# EAGLE design SaV64_v140 (EAGLE 7.4.0)
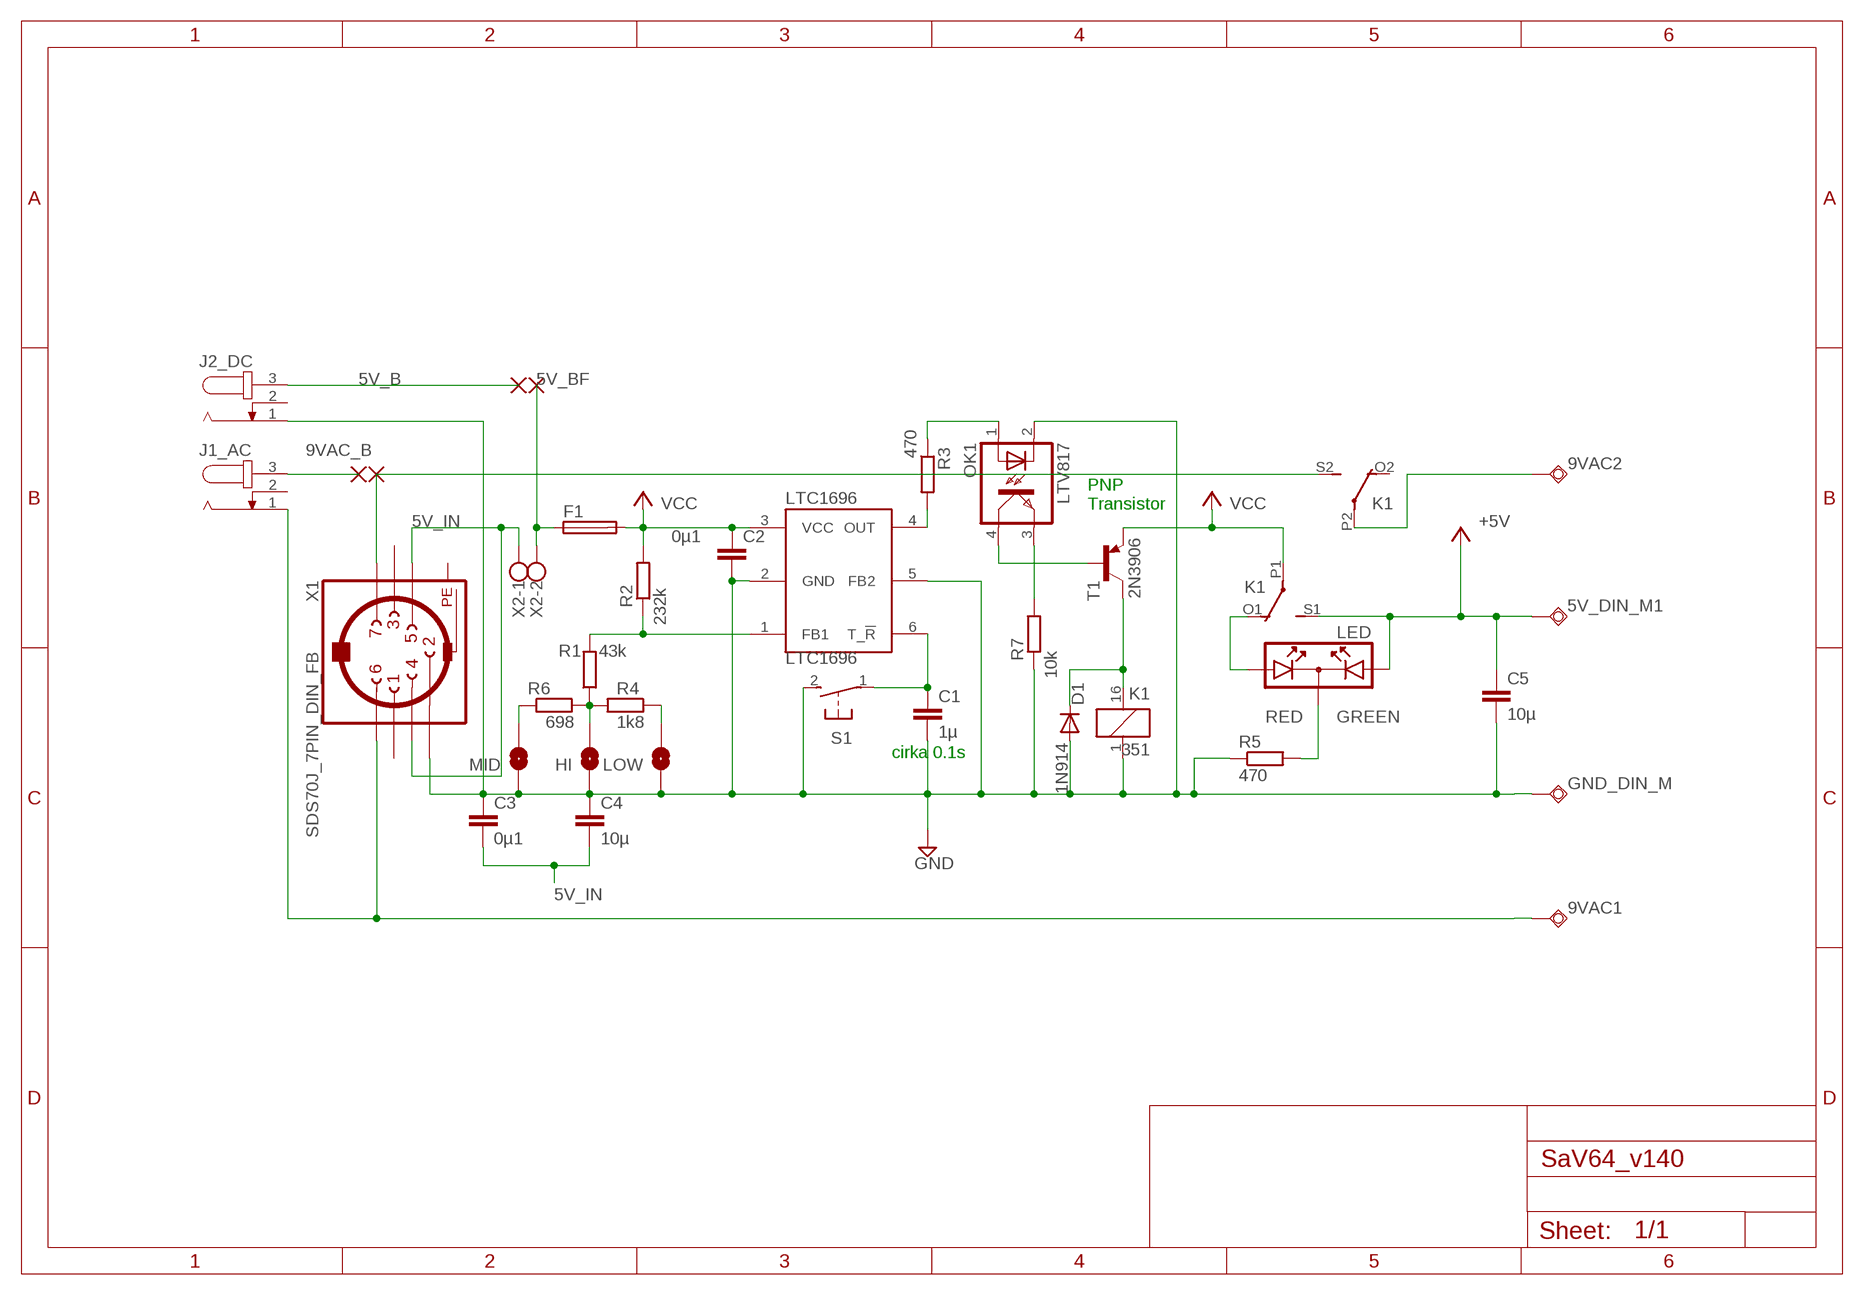
[diagram p0: schematic, sheet 1]

## Parts
5V_DIN_M1  TPSQPAD1-17  [P1-17]
9VAC1  TPSQPAD1-17  [P1-17]
9VAC2  TPSQPAD1-17  [P1-17]
C1  1µ  C-EU050-024X044  [C050-024X044]
C2  0µ1  C-EU050-024X044  [C050-024X044]
C3  0µ1  C-EU050-024X044  [C050-024X044]
C4  10µ  C-EU050-024X044  [C050-024X044]
C5  10µ  C-EU050-024X044  [C050-024X044]
D1  1N914  1N4148DO35-10  [DO35-10]
F1  SHK20L  [SHK20L]
GND_DIN_M  TPSQPAD1-17  [P1-17]
HI  SJR  [SJ_ROUNDED]
J1_AC  JACK-PLUG0  [SPC4077]
J2_DC  JACK-PLUG0  [SPC4077]
K1  351  [351]
LED  DUOLED  [DUOLED]
LOW  SJR  [SJ_ROUNDED]
LTC1696  LTC1696  [SOT23-6]
MID  SJR  [SJ_ROUNDED]
OK1  LTV817  LTV816S  [SMD4]
R1  43k  R-EU_R1206W  [R1206W]
R2  232k  R-EU_R1206W  [R1206W]
R3  470  R-EU_R1206W  [R1206W]
R4  1k8  R-EU_R1206W  [R1206W]
R5  470  R-EU_0207/12  [0207/12]
R6  698  R-EU_R1206W  [R1206W]
R7  10k  R-EU_R1206W  [R1206W]
S1  31-XX  [B3F-31XX]
T1  2N3906  [TO92]
X1  SDS70J_7PIN_DIN_FB  [SDS-70J_7PIN_FEMALE_DIN]
X2  W237-102  [W237-102]

## Nets
5V_B: J2_DC.3
5V_BF: F1.1A F1.1B X2.2
5V_IN: C3.2 C4.2 X1.4 X1.5 X2.1
9VAC2: 9VAC2.TP K1.P2(3:P)
9VAC_B: J1_AC.3
+5V: 5V_DIN_M1.TP C5.1 K1.S1(2:S) LED.A1
GND: C1.2 C2.2 C3.1 C4.1 C5.2 D1.A GND_DIN_M.TP HI.P$1 J2_DC.1 K1.1 LOW.P$1 LTC1696.2(GND) LTC1696.5(FB2) MID.P$1 OK1.2(C) R5.1 R7.1 S1.2(S) X1.2
N$1: LTC1696.1(FB1) R1.2 R2.1
N$2: LED.K R5.2
N$3: MID.P$2 R6.1
N$4: OK1.4(COL) T1.2(B)
N$5: HI.P$2 R1.1 R4.2 R6.2
N$6: C1.1 LTC1696.6(T_!R) S1.1(P)
N$7: LTC1696.4(OUT) R3.2
N$8: K1.S2(3:S) X1.7
N$9: LOW.P$2 R4.1
N$10: K1.O1(2:O) LED.A2
N$11: D1.C K1.16 T1.1(C)
N$12: 9VAC1.TP J1_AC.1 X1.6
N$16: OK1.1(A) R3.1
N$17: OK1.3(EMIT) R7.2
VCC: C2.1 F1.2A F1.2B K1.P1(2:P) LTC1696.3(VCC) R2.2 T1.3(E)
Unconnected: J1_AC.2 J2_DC.2 K1.O2(3:O) X1.1 X1.3

## Notes on the sheet
- PNP
  Transistor
- RED | GREEN
- cirka 0.1s

## Power pins joined to a net without a drawn wire
PE: X1.PE X1.PE@(PE)

## Library data of the parts
5V_DIN_M1 9VAC1 9VAC2 GND_DIN_M = testpad:TPSQ: Test pad
C1-C5 = rcl:C-EU: CAPACITOR, European symbol
D1 = diode:1N4148: DIODE high speed (Philips)
F1 = fuse:SHK20L: FUSE HOLDER 5 x 20 mm, SH contact, SHH1 Schukat, E1073 Buerklin; OC_FARNELL: unknown; OC_NEWARK: unknown
HI LOW MID = jumper:SJ: SMD solder JUMPER
J1_AC J2_DC = con-jack:JACK-PLUG: DC POWER JACK Power Jack, DC, Right Angle, Through Hole, Rated 5A at 16VDC, PC Terminals Distributor: Farnell (www.Farnell.de) Drawing: 84N1161.pdf / 84N1162.pdf Manufacturer: SPC Technology (www.spctechnology.com) Type: SPC4077 / SPC 4078; OC_FARNELL: unknown; OC_NEWARK: unknown
K1 = relay:351: RELAY 2 x switch, Omron; OC_FARNELL: unknown; OC_NEWARK: unknown
LED = special:DUOLED: Duo LED
LTC1696 = _OVG64:LTC1696
OK1 = optocoupler:LTV816: OPTO COUPLER Source: LITEON, LTV816.pdf; OC_FARNELL: unknown; OC_NEWARK: unknown
R1-R7 = resistor:R-EU_: RESISTOR, European symbol
S1 = switch-omron:31-XX: OMRON SWITCH; MPN: B3F-3100; OC_FARNELL: 959704; OC_NEWARK: 36M3582
T1 = transistor-pnp:2N3906: PNP Transistor
X1 = mabp8sn:SDS70J_7PIN_DIN_FB: Female CONNECTOR 7 pins with shield, horizontal (DIN 45329); OC_FARNELL: unknown; OC_NEWARK: unknown
X2 = con-wago-500:W237-102: WAGO SCREW CLAMP; MPN: 237-102; OC_FARNELL: unknown; OC_NEWARK: 70K9898

## Board
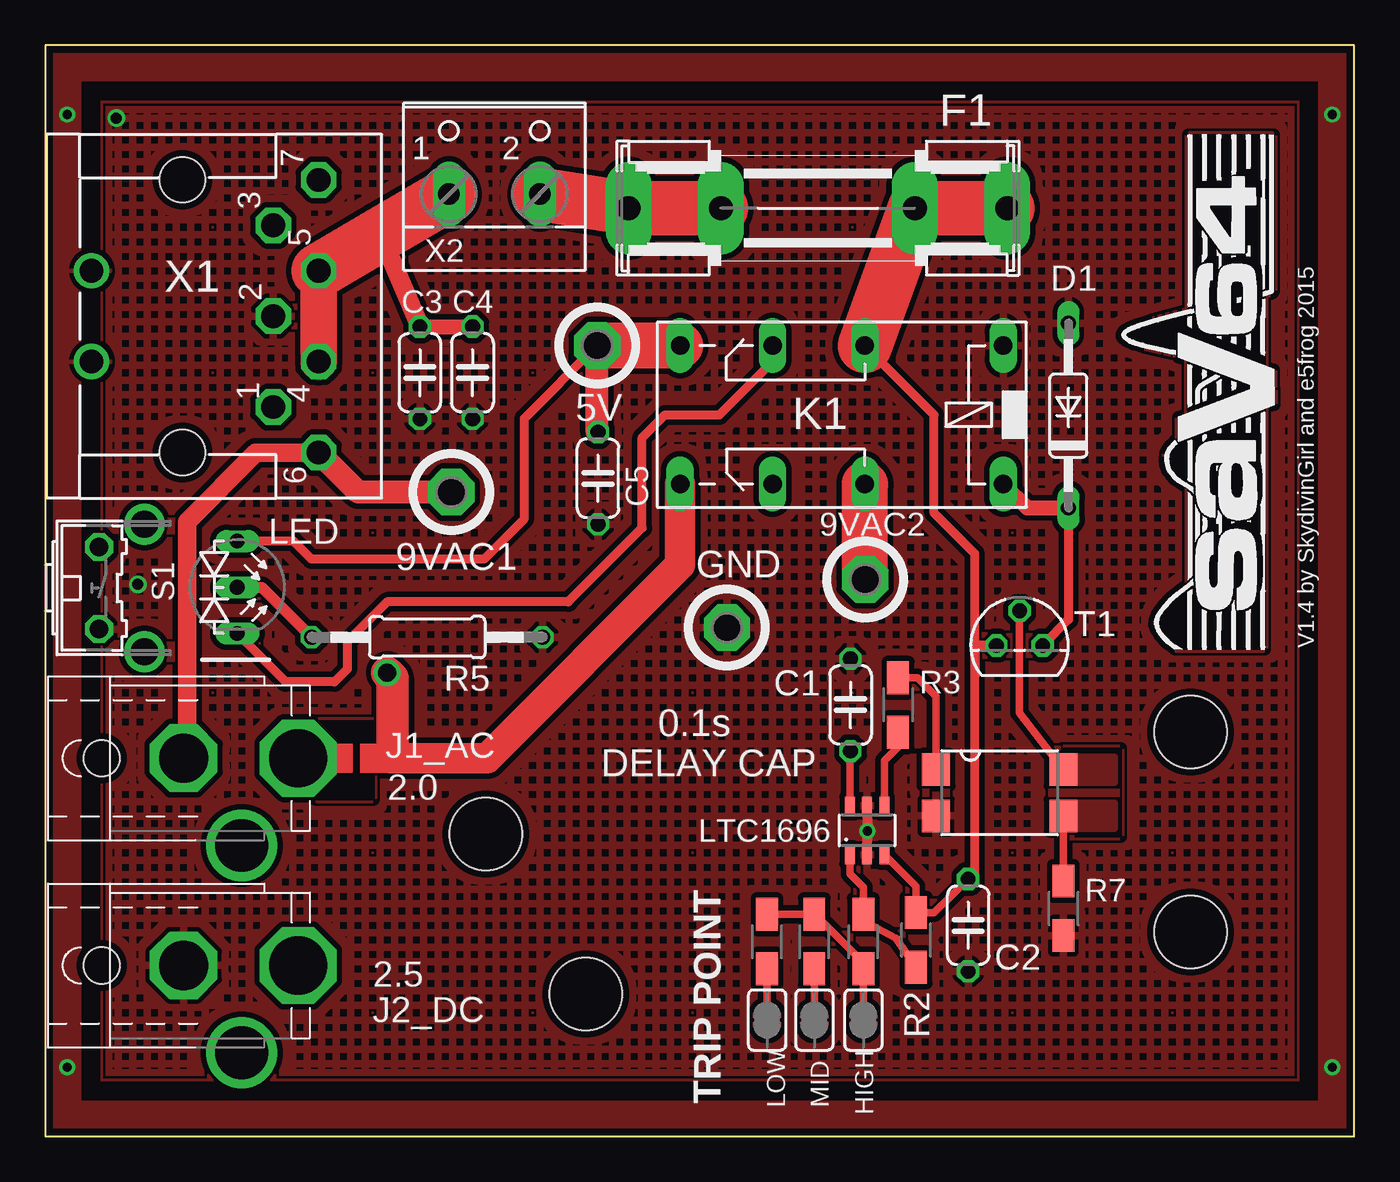
[diagram p1: board, top side]
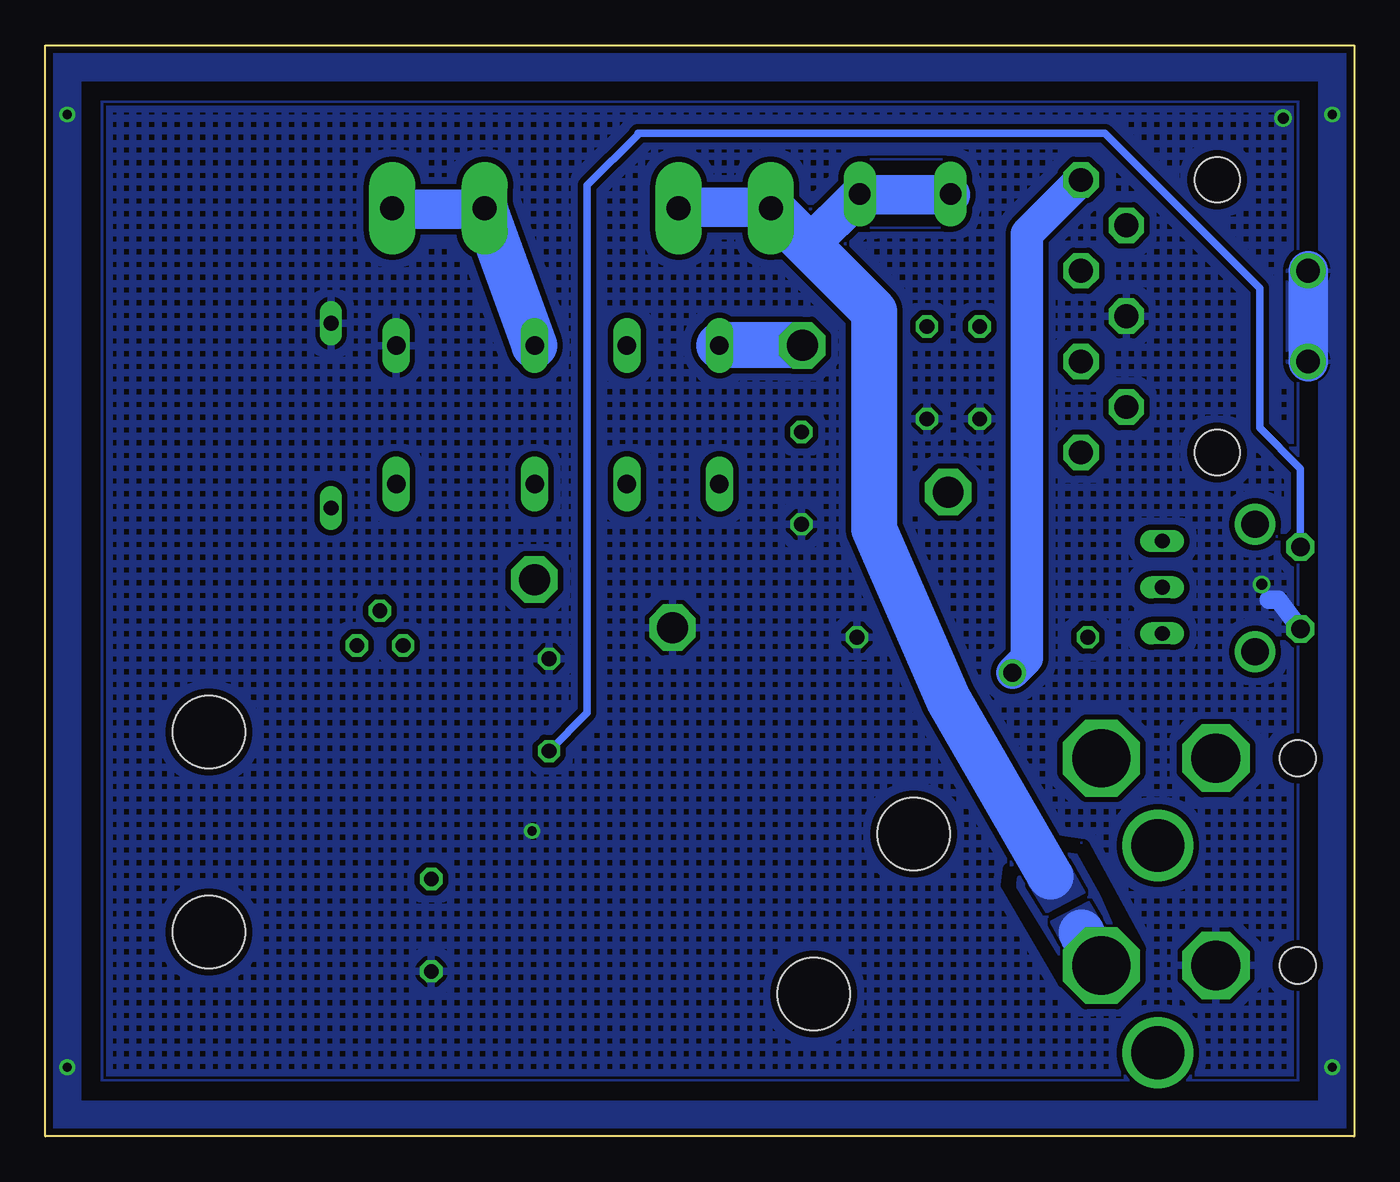
[diagram p2: board, bottom side, seen from below]

Size 72 x 60 mm. Coordinates in mm from the lower left corner, seen from the top.
Outline: 0,0 72,0 72,60 0,60 0,0
Copper layers (1*16): Top 0.0356mm / dielectric 1.5011mm / Bottom 0.0356mm
Design rules "oshpark": minimum track width 6mil, minimum drill 13mil, track to track 6mil, track to pad 6mil, pad to pad 6mil, via to via 6mil, smd to smd 6mil, copper to edge 15mil, drill to drill 6mil, minimum pad ring 7mil, minimum via ring 7mil, stop-mask expansion 3mil, vias tented up to drill 0mil, thermal gap 10mil
Holes 4 mm at 29.73,7.82 24.22,16.62 63,11.25 63,22.25
tRestrict: area 2,57 to 70,58; area 2,2 to 70,3; area 69,2 to 70,58; area 2,2 to 3,58; area 59.2,26.8 to 67.6,55.1; area 14.8,18.5 to 18.1,22.9; 3 lines
bRestrict: area 2,57 to 70,58; area 2,2 to 70,3; area 69,2 to 70,58; area 2,2 to 3,58; area 22.5,50 to 26.7,53.6; area 11.8,10.1 to 17.4,16.2; area 15.8,8.5 to 19.1,15.4

### Footprints (pad centres in the part's own frame; a part is rotated, then mirrored left to right if it is on the bottom)
P1-17 = drill 1.702 pad 2.54 octagon: TP 0,0
C050-024X044 = drill 0.813 octagon: 1 -2.54,0; 2 2.54,0
DO35-10 = drill 0.813 long: A 5.08,0; C -5.08,0
SHK20L = drill 1.321 pad 2.54 long: 1A -10.414,0; 1B -5.334,0; 2A 10.414,0; 2B 5.334,0
SJ_ROUNDED = smd 0.305 x 0.152: P$1 0.813,-0.013; P$2 -0.8,0
SPC4077 = drill 2.7 octagon: 1 -3.2,0 | drill 2.9: 2 0,-4.8 | drill 3.2 octagon: 3 3.1,0 | hole 2: -7.7,0
351 = drill 1.016 long: 1 -3.81,-3.81; 16 -3.81,3.81; O1 8.89,-3.81; O2 8.89,3.81; P1 3.81,-3.81; P2 3.81,3.81; S1 13.97,-3.81; S2 13.97,3.81
DUOLED = drill 0.813 long: A1 -3.81,0; A2 1.27,0; K -1.27,0
SOT23-6 = smd 1 x 0.55: 1 -1.35,0.95; 2 -1.35,0; 3 -1.35,-0.95; 4 1.35,-0.95; 5 1.35,0; 6 1.35,0.95
SMD4 = smd 1.78 x 1.55: 1 -1.27,-3.5; 2 1.27,-3.5; 3 1.27,3.5; 4 -1.27,3.5
R1206W = smd 1.8 x 1.2: 1 -1.499,0; 2 1.499,0
0207/12 = drill 0.813 octagon: 1 -6.35,0; 2 6.35,0
B3F-31XX = drill 1.016 octagon: 1 -2.261,-1.245; 2 2.261,-1.245 | drill 1.499 pad 2.159: 3 -3.505,1.245; 4 3.505,1.245
TO92 = drill 0.813 octagon: 1 1.27,0; 2 0,1.905; 3 -1.27,0
SDS-70J_7PIN_FEMALE_DIN = drill 1.3 octagon: 1 5,4.92; 2 0,4.92; 3 -5,4.92; 4 2.5,7.42; 5 -2.5,7.42; 6 7.5,7.42; 7 -7.5,7.42 | drill 1.3: PE -2.5,-5.08; PE@ 2.5,-5.08 | hole 2.5: 7.5,-0.08; -7.5,-0.08
W237-102 = drill 1.194 long: 1 -2.5,-1.27; 2 2.5,-1.27

### Placement (x,y rotation side)
5V_DIN_M1  30.36,43.5 0 top
9VAC1  22.33,35.43 0 top
9VAC2  45.1,30.62 0 top
C1  44.3,23.73 90 top
C2  50.77,11.61 270 top
C3  20.6,42 90 top
C4  23.5,42 90 top
C5  30.4,36.2 270 top
D1  56.28,39.64 90 top
F1  42.5,51.05 0 top
GND_DIN_M  37.5,27.98 0 top
HI  45,6.4 270 top
J1_AC  10.8,20.8 0 top
J2_DC  10.8,9.4 0 top
K1  48.9,39.69 180 top
LED  10.56,28.93 270 top
LOW  39.7,6.4 270 top
LTC1696  45.2,16.83 90 top
MID  42.3,6.4 270 top
OK1  52.5,18.9 270 top
R1  45,10.71 90 top
R2  47.9,10.81 90 top
R3  46.91,23.73 270 top
R4  39.7,10.71 90 top
R5  21,27.45 180 top
R6  42.3,10.71 90 top
R7  56.01,12.54 90 top
S1  4.2,30.16 270 top
T1  53.6,27 0 top
X1  7.61,45.11 270 top
X2  24.7,53.1 0 top

### Tracks (layer width: path | path; a pad name or v marks a point on that pad's centre or on a via)
5V_B
  Bottom 2.54: J2_DC.3 15,11.2
  pour Bottom: 13.9,11.5 14,11.9 14.6,12.9 16.7,11.8 16,10.5 15.1,11
5V_BF
  Top 3: X2.2 F1.1A F1.1B
  Bottom 2.54: F1.1A 26.4,45.36 26.4,33.4 22.3,24 16.7,14.3
  pour Bottom: 15.8,15.1 15.5,14.6 14.8,13.4 16.9,12.3 17.9,13.9 17,14.4
5V_IN
  Top 0.813: C3.2 C4.2
  Top 1.016: C3.2 18.45,49.62
  Top 2: X1.4 X1.5
  Top 3: X1.5 18.45,49.62 X2.1
9VAC2
  Top 2.54: 9VAC2.TP 45.1,35.86 K1.P2
+5V
  Top 0.5: 5V_DIN_M1.TP 26.35,39.49 26.35,33.97 24.13,31.75 14.63,31.75 13.64,32.74 LED.A1
  Top 1.27: C5.1 30.36,38.74 5V_DIN_M1.TP
  Top 2.54: 5V_DIN_M1.TP K1.S1
  Bottom 2.54: 5V_DIN_M1.TP K1.S1
GND  (via drill 0.5, 0.6)
  Top 0.55: LTC1696.2 v45.23,16.8 LTC1696.5
  Bottom 1.016: S1.2 4.18,29.52 4.68,29.52
  other vias: 3.9,56 5.08,30.36
  pour Bottom (isolate 0.3, hatched): 2.48,57.52 69.56,57.47 69.55,2.44 2.45,2.44
  pour Top (isolate 0.3, hatched): 2.49,57.51 69.48,57.5 69.49,2.46 2.45,2.44
N$1
  Top 0.305: 45,12.28 R1.2
  Top 0.406: R2.1 47.88,9.36 46.8,10.9 45.37,11.66 R1.2 | 45,12.28 45,13.7 44.25,14.45 LTC1696.1
N$2
  Top 0.61: LED.K 11.9,30.2 R5.2
N$3
  Top 0.406: MID.P$2 R6.1
N$4
  Top 0.406: OK1.4 53.6,23.3 T1.2
  pour Top (no thermals): 56.79,20.86 58.8,20.85 58.8,19.47 56.78,19.48
N$5
  Top 0.406: R4.2 R6.2 42.9,11.66 44.35,10.21 45.03,9.53 R1.1 HI.P$2
N$6
  Top 0.406: LTC1696.6 44.25,21.15 C1.1
  Bottom 0.406: S1.1 2.96,36.72 5.2,38.96 5.2,46.64 13.72,55.16 39.4,55.16 39.4,55.1 42.2,52.3 42.2,23.29 C1.1
N$7
  Top 0.406: LTC1696.4 46.15,20.65 47,21.5 47,21.9 R3.2
N$8  (via drill 1)
  Top 0.813: 19.1,21.6 19,21.5 19,20.8
  Top 1.676: K1.S2 34.92,31.43 24.29,20.8 19,20.8
  Top 1.778: 19.1,21.6 19.1,25.2 v18.8,25.5
  Bottom 1.778: X1.7 18,49.64 18,26.3 v18.8,25.5
N$9
  Top 0.406: LOW.P$2 R4.1
N$10
  Top 0.5: LED.A2 13.22,25 15.9,25 16.6,25.7 16.6,27.2 18.8,29.4 28.77,29.4 32.83,33.47 32.83,38.42 34.09,39.69 37.09,39.69 40.01,42.61 K1.O1
N$11
  Top 0.5: D1.C 56.28,28.44 T1.1
  Top 0.813: K1.16 54.02,34.56 D1.C
N$12
  Top 1.016: X1.6 15.01,37.59 11.58,37.59 7.8,33.8 7.8,21.56 J1_AC.1
  Top 1.27: 9VAC1.TP 17.21,35.43 X1.6
N$13
  Bottom 2.184: 22.2,51.8 27.2,51.8 30.1,48.9
N$14
  Bottom 2.184: 32.1,51.1 37.2,51.1
N$15
  Bottom 2.184: 47.8,51 52.9,51
  Bottom 2.54: 45.1,43.5 47.8,51
N$16
  Top 0.406: OK1.1 49,24.2 47.97,25.23 R3.1
N$17
  Top 0.406: R7.2 OK1.3
  pour Top (no thermals): 56.79,18.32 58.8,18.32 58.8,16.94 56.78,16.94
PE  (via drill 0.5)
  Bottom 2.184: X1.PE X1.PE@
  other vias: 1.2,56.2 1.2,3.8 70.8,3.8 70.8,56.2
  pour Bottom (rank 2): 0,60 72,60 72,0 0,0
  pour Top (rank 2): 0,60 72,60 72,0 0,0
VCC
  Top 0.406: LTC1696.3 47.89,13.74 R2.2 48.88,12.31 C2.1
  Top 0.5: K1.P1 48.9,39.69 48.9,34.29 51.12,32.07 51.12,23.5 | R2.2 47.99,12.26 | 51.12,23.5 51.12,14.54 C2.1 | T1.3 51.15,27 51.12,23.5
  Top 3: F1.2A F1.2B K1.P1
(copper drawn outside any net)
  shapes: Top area x2

### Text on the board
tPlace: 5V | 9VAC2 | 9VAC1 | GND | V1.4 by SkydivinGirl and e5frog 2015 | 0.1s | DELAY CAP | 2.0 | 2.5 | TRIP POINT | LOW | MID | HIGH